# Altium schematic sheet Esp32-S3-Mainboard.SchDoc
size A4; SheetNumber: 2; SheetTotal: 4
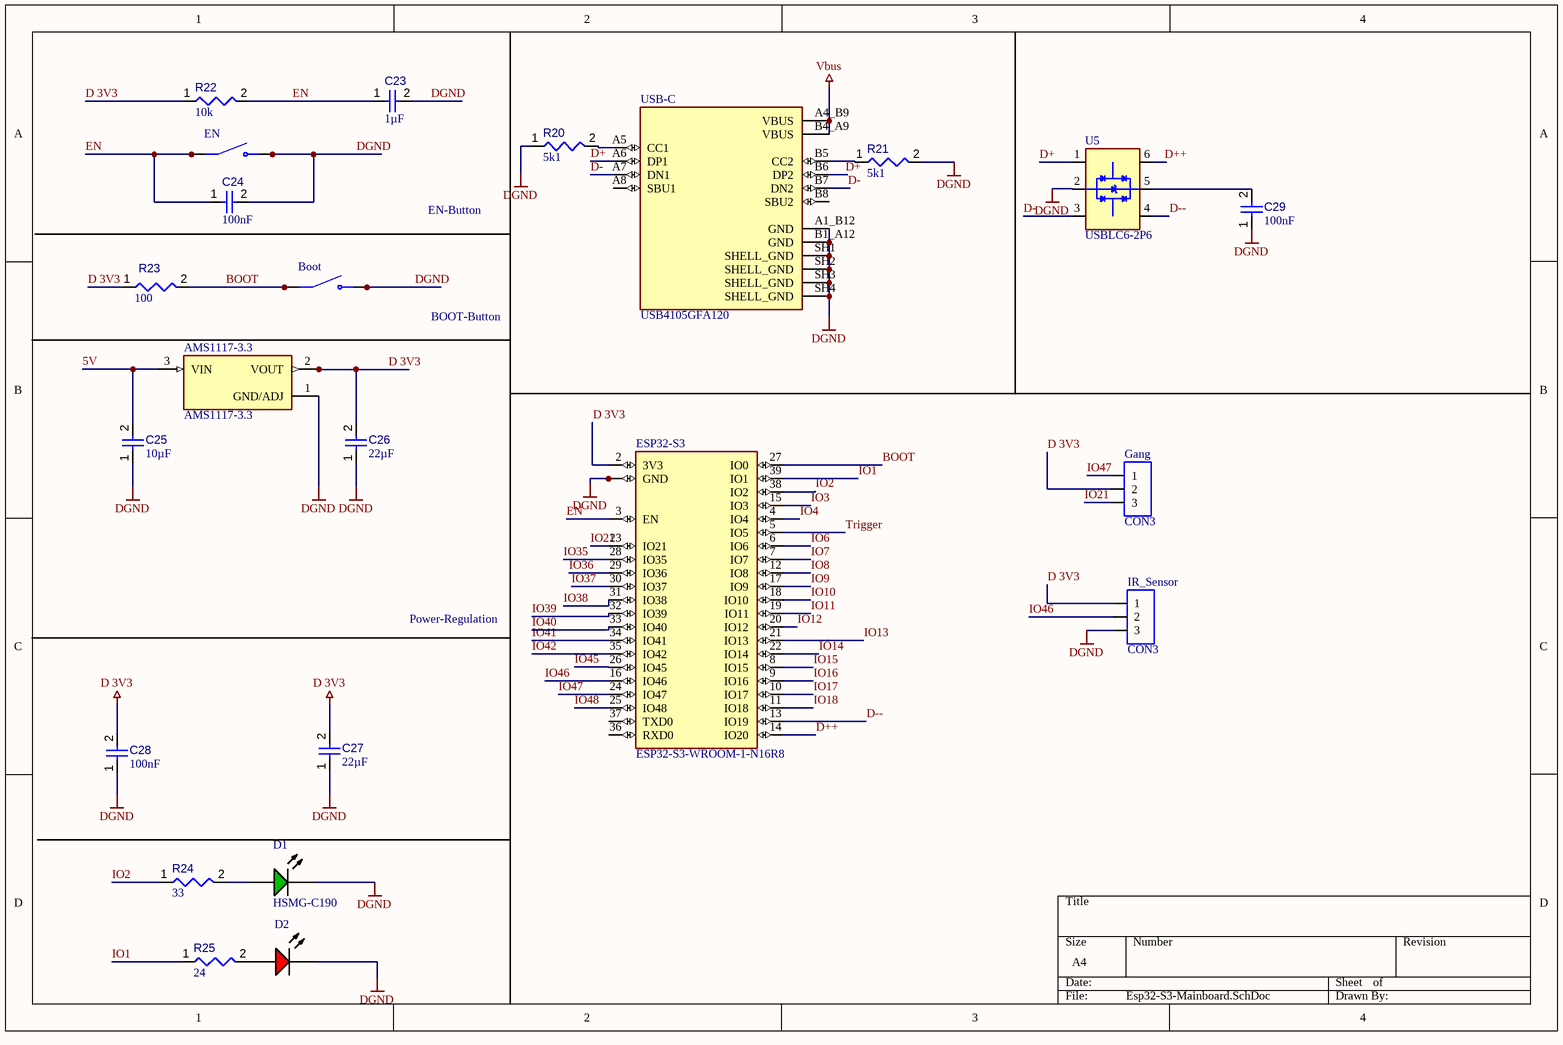
[diagram p0: Esp32-S3-Mainboard.SchDoc]

## Parts
AMS1117-3.3  AMS1117-3.3  [SOT229P700X180-4N]
Boot  FSM2JSMLTR  [SW_1571527-2]  (value not drawn)
C23  value 1µF  [CAPC1608X90X35ML15T15]  (hidden comment: Capacitor 1uF +/- 10% 16V 0603)
C24  value 100nF  [CAPC1608X90X40NL10T20]  (hidden comment: Capacitor 100 nF +/-10% 50 V 0603)
C25  value 10µF  [CAPC0603(1608)100_L]  (hidden comment: Capacitor 10µF +/-20% 10V 0603)
C26  value 22µF  [CAPC0805(2012)145_L]  (hidden comment: Capacitor 22µF +/-40% 16V 0805)
C27  value 22µF  [CAPC0805(2012)145_L]  (hidden comment: Capacitor 22µF +/-40% 16V 0805)
C28  value 100nF  [CAPC1608X90X40NL10T20]  (hidden comment: Capacitor 100 nF +/-10% 50 V 0603)
C29  value 100nF  [CAPC0402(1005)60_L]  (hidden comment: Capacitor 100nF +/-20% 50V 0402)
D1  HSMG-C190  [AVAG-HSMX-C190_V]
D2  19-217/R6C-AL1M2VY/3T  [EVRL-0603-2_V]  (value not drawn)
EN  FSM2JSMLTR  [SW_1571527-2]  (value not drawn)
ESP32-S3  ESP32-S3-WROOM-1-N16R8  [ESP32S3WROOM1N8R2]
Gang  CON3  [Sip-3]
IR_Sensor  CON3  [Sip-3]
R20  value 5k1  [RESC1608X55X25ML10T15]  (hidden comment: Resistor 100k +/-1% 0603 100 mW)
R21  value 5k1  [RESC1608X55X25ML10T15]  (hidden comment: Resistor 100k +/-1% 0603 100 mW)
R22  value 10k  [RESC1608X55X25ML10T15]  (hidden comment: Resistor 10k +/-1% 0603 100 mW)
R23  value 100  [RESC1608X55X25ML10T15]  (hidden comment: Resistor 10k +/-1% 0603 100 mW)
R24  value 33  [RESC1608X55X25ML10T15]  (hidden comment: Resistor 10k +/-1% 0603 100 mW)
R25  value 24  [RESC1608X55X25ML10T15]  (hidden comment: Resistor 10k +/-1% 0603 100 mW)
U5  USBLC6-2P6  [SOT50P160X60-6N]
USB-C  USB4105GFA120  [GCT_USB4105GFA120]

## Nets
D 3V3: AMS1117-3.3.2(VOUT) C26.2 C27.2 C28.2 ESP32-S3.2(3V3) Gang.2 IR_Sensor.1 R22.1 R23.1
DGND: AMS1117-3.3.1(GND/ADJ) Boot.3(NO) Boot.4(NO) C23.2 C24.2 C25.1 C26.1 C27.1 C28.1 C29.1 D1.2(K) D2.2(K) EN.3(NO) EN.4(NO) ESP32-S3.1(GND) ESP32-S3.40(GND) ESP32-S3.41(GND) ESP32-S3.42(GND) ESP32-S3.43(GND) ESP32-S3.44(GND) ESP32-S3.45(GND) ESP32-S3.46(GND) ESP32-S3.47(GND) ESP32-S3.48(GND) ESP32-S3.49(GND) IR_Sensor.3 R20.1 R21.2 U5.2(GND) USB-C.A1_B12(GND) USB-C.B1_A12(GND) USB-C.SH1(SHELL_GND) USB-C.SH2(SHELL_GND) USB-C.SH3(SHELL_GND) USB-C.SH4(SHELL_GND)
Vbus: USB-C.A4_B9(VBUS) USB-C.B4_A9(VBUS)
5V: AMS1117-3.3.3(VIN) C25.2
BOOT: Boot.1(COM) Boot.2(COM) ESP32-S3.27(IO0) R23.2
D+: U5.1(I/O1_1) USB-C.A6(DP1) USB-C.B6(DP2)
D++: ESP32-S3.14(IO20) U5.6(I/O1_2)
D-: U5.3(I/O2_1) USB-C.A7(DN1) USB-C.B7(DN2)
D--: ESP32-S3.13(IO19) U5.4(I/O2_2)
EN: C23.1 C24.1 EN.1(COM) EN.2(COM) ESP32-S3.3(EN) R22.2
IO1: ESP32-S3.39(IO1) R25.1
IO2: ESP32-S3.38(IO2) R24.1
IO3: ESP32-S3.15(IO3)
IO4: ESP32-S3.4(IO4)
IO6: ESP32-S3.6(IO6)
IO7: ESP32-S3.7(IO7)
IO8: ESP32-S3.12(IO8)
IO9: ESP32-S3.17(IO9)
IO10: ESP32-S3.18(IO10)
IO11: ESP32-S3.19(IO11)
IO12: ESP32-S3.20(IO12)
IO13: ESP32-S3.21(IO13)
IO14: ESP32-S3.22(IO14)
IO15: ESP32-S3.8(IO15)
IO16: ESP32-S3.9(IO16)
IO17: ESP32-S3.10(IO17)
IO18: ESP32-S3.11(IO18)
IO21: ESP32-S3.23(IO21) Gang.3
IO35: ESP32-S3.28(IO35)
IO36: ESP32-S3.29(IO36)
IO37: ESP32-S3.30(IO37)
IO38: ESP32-S3.31(IO38)
IO39: ESP32-S3.32(IO39)
IO40: ESP32-S3.33(IO40)
IO41: ESP32-S3.34(IO41)
IO42: ESP32-S3.35(IO42)
IO45: ESP32-S3.26(IO45)
IO46: ESP32-S3.16(IO46) IR_Sensor.2
IO47: ESP32-S3.24(IO47) Gang.1
IO48: ESP32-S3.25(IO48)
Trigger: ESP32-S3.5(IO5)
NetC29_2: C29.2 U5.5(VBUS)
NetD1_1: D1.1(A) R24.2
NetD2_1: D2.1(A) R25.2
NetR20_2: R20.2 USB-C.A5(CC1)
NetR21_1: R21.1 USB-C.B5(CC2)

Not connected (* = marked no-connect by the designer): ESP32-S3 36(RXD0) 37(TXD0); USB-C A8(SBU1) B8(SBU2)

## Notes on the sheet
- EN-Button
- BOOT-Button
- Power-Regulation

## Library data of the parts
AMS1117-3.3 = AMS1117-3.3: LDO Voltage Regulators 800MA LDO LINEAR REG; MF: ams AG; SnapEDA_Link: https://www.snapeda.com/parts/AMS1117-3.3/ams/view-part/?ref=snap; Package: SOT-223 Seeed Technology; Value: *; MP: AMS1117-3.3; Check_prices: https://www.snapeda.com/parts/AMS1117-3.3/ams/view-part/?ref=eda
Boot EN = CMP-016-000000-1: Switch Tactile OFF (ON) SPST Round Button Gull Wing 0.05A 24VDC 0.98N SMD T/R; MF: TE Connectivity; SnapEDA_Link: https://www.snapeda.com/parts/FSM2JSMLTR/TE+Connectivity+ALCOSWITCH+Switches/view-part/?ref=snap; Package: None; Check_prices: https://www.snapeda.com/parts/FSM2JSMLTR/TE+Connectivity+ALCOSWITCH+Switches/view-part/?ref=eda; Design Item ID: FSM2JSMLTR; Source: FSM2JSMLTR.SchLib; Value: *; MP: FSM2JSMLTR
C23 = CMP-001-00004-6: Chip Capacitor, 1 uF, +/- 10%, 16 V, 0603 (1608 Metric); Capacitor Type: Ceramic; Mounting Technology: SM; RoHS Compliant: True; Min Operating Temperature: -55°C; Case/Package: 0603; Pins: 2; Voltage Rating: 16V; Max Operating Temperature: 125°C; Tolerance: 10%
C24 C28 = CMP-001-00017-6: Chip Capacitor, 100 nF, +/- 10%, 50 V, 0603 (1608 Metric); Voltage Rating: 50V; Capacitor Type: Ceramic; Tolerance: 10%; Mounting Technology: SM; Max Operating Temperature: 125°C; RoHS Compliant: True; Pins: 2; Case/Package: 0603; Min Operating Temperature: -55°C
C25 = CMP-001-00075-4: Chip Capacitor, 10µF +/-20%, 10V, 0603, Thickness 1 mm; Tolerance: 10%; Voltage Rating: 10V; Max Operating Temperature: 85°C; Pins: 2; Case/Package: 0603; Mounting Technology: SMT; Min Operating Temperature: -55°C
C26 C27 = CMP-001-00081-4: Chip Capacitor, 22µF +/-40%, 16V, 0805, Thickness 1.45 mm; Tolerance: 5%; Voltage Rating: 16V; Mounting Technology: SMT; Pins: 2; Max Operating Temperature: 85°C; Case/Package: 0805; Min Operating Temperature: -55°C
C29 = CMP-001-00067-3: Chip Capacitor, 100nF +/-20%, 50V, 0402, Thickness 0.6 mm; Tolerance: 10%; Min Operating Temperature: -55°C; Pins: 2; Case/Package: 0402; Max Operating Temperature: 85°C; Voltage Rating: 50V; Mounting Technology: SMT
D1 = CMP-007-00013-2: LED Uni-Color Green, 52 mW, 20 mA, -40 to 85 degC, 2-Pin SMD, RoHS, Tape and Reel; Manufacturer: Avago; Forward Current: 20mA; Viewing Angle: 170degrees; Luminous Intensity: 15mcd; Lens Style: Diffused; Forward Voltage: 2.2V; Power: 52mW; Mounting Technology: SM; RoHS Compliant: True; Packaging: TapeandReel; Illumination Colour: Green; Datasheet URL: http://docs.avagotech.com/docs/AV02-0551EN; Min Operating Temperature: -40°C; Max Operating Temperature: 85°C; Pins: 2; Package Description: 2-Pin Surface Mount Device, Body 1.6 x 0.8 mm, Height 0.9 mm; Nominal Vf: 2.2V; Case/Package: 0603; Manufacturer URL: http://www.avagotech.com/; Datasheet Version: Mar-12; Colour: Green; Package Reference: HSMX-C190; Package Quantity: 4000
D2 = CMP-007-00004-2: Chip LED, Red, 5 V, 25 mA, -40 to 85 degC, 2-Pin SMD (0603), RoHS, Tape and Reel; Manufacturer: Everlight Electronics; Forward Voltage: 2.2V; Lens Style: Clear; Package Reference: 0603; Datasheet Version: Rev. 1, 01/2005; Mounting Technology: SM; RoHS Compliant: False; Datasheet URL: https://datasheet.ciiva.com/4688/el-19-217-r6c-al1m2vy-3tpdf-187026-4688713.pdf; Case/Package: 0603; Colour: Red; Manufacturer URL: http://www.everlight.com/; Package Description: 2-Pin Surface Mount Device, Body 1.6 x 0.8 mm
ESP32-S3 = ESP32-S3-WROOM-1-N16R8: Bluetooth, WiFi 802.11b/g/n, Bluetooth v5.0 Transceiver Module 2.4GHz PCB Trace Surface Mount; MF: Espressif Systems; SnapEDA_Link: https://www.snapeda.com/parts/ESP32-S3-WROOM-1-N16R8/Espressif+Systems/view-part/?ref=snap; Package: NON STANDARD Espressif Systems; Value: *; MP: ESP32-S3-WROOM-1-N16R8; Check_prices: https://www.snapeda.com/parts/ESP32-S3-WROOM-1-N16R8/Espressif+Systems/view-part/?ref=eda
Gang IR_Sensor = CON3: Stecker
R20 R21 = CMP-009-00023-5: Chip Resistor, 100 KOhm, +/- 1%, 0.1 W, -55 to 155 degC, 0603 (1608 Metric); Voltage Rating: 50V; Power: 100mW; Max Operating Temperature: 155°C; RoHS Compliant: True; Tolerance: 1%; Pins: 2; Case/Package: 0603; Mounting Technology: SM; Min Operating Temperature: -55°C
R22-R25 = CMP-009-00017-5: Chip Resistor, 10 KOhm, +/- 1%, 01 W, -55 to 155 degC, 0603 (1608 Metric); Voltage Rating: 50V; Power: 100mW; RoHS Compliant: True; Min Operating Temperature: -55°C; Pins: 2; Case/Package: 0603; Mounting Technology: SM; Max Operating Temperature: 155°C; Tolerance: 1%
U5 = USBLC6-2P6: 17V Clamp 5A (8/20Âµs) Ipp Tvs Diode Surface Mount SOT-666; MF: STMicroelectronics; SnapEDA_Link: https://www.snapeda.com/parts/USBLC6-2P6/STMicroelectronics/view-part/?ref=snap; Package: SOT-666 STMicroelectronics; Value: *; MP: USBLC6-2P6; Check_prices: https://www.snapeda.com/parts/USBLC6-2P6/STMicroelectronics/view-part/?ref=eda
USB-C = USB4105GFA120: USB CONN, 2.0 TYPE C, RCPT, 16POS, SMT; USB Connector Type:USB Type C; USB Standard:USB 2.0; Gender:Receptacle; No. of Positions:16Positions; Connector Mounting:Surface Mount, Through Hole Mount; Orientation:Right Angle RoHS Compliant: Yes; MF: Global Connector Technology; SnapEDA_Link: https://www.snapeda.com/parts/USB4105GFA120/Global+Connector+Technology/view-part/?ref=snap; Package: None; Value: *; MP: USB4105GFA120; Check_prices: https://www.snapeda.com/parts/USB4105GFA120/Global+Connector+Technology/view-part/?ref=eda